# Altium schematic sheet DE0_Nano.SchDoc
size A4; Author: Audran; CompanyName: Goldorak; Address1: Electrolab; Address2: 52 rue Paul Lescop; Address3: 92000 Nanterre; DocumentNumber: 3; SheetNumber: 3; SheetTotal: 8; ProjectName: Cartes_2017
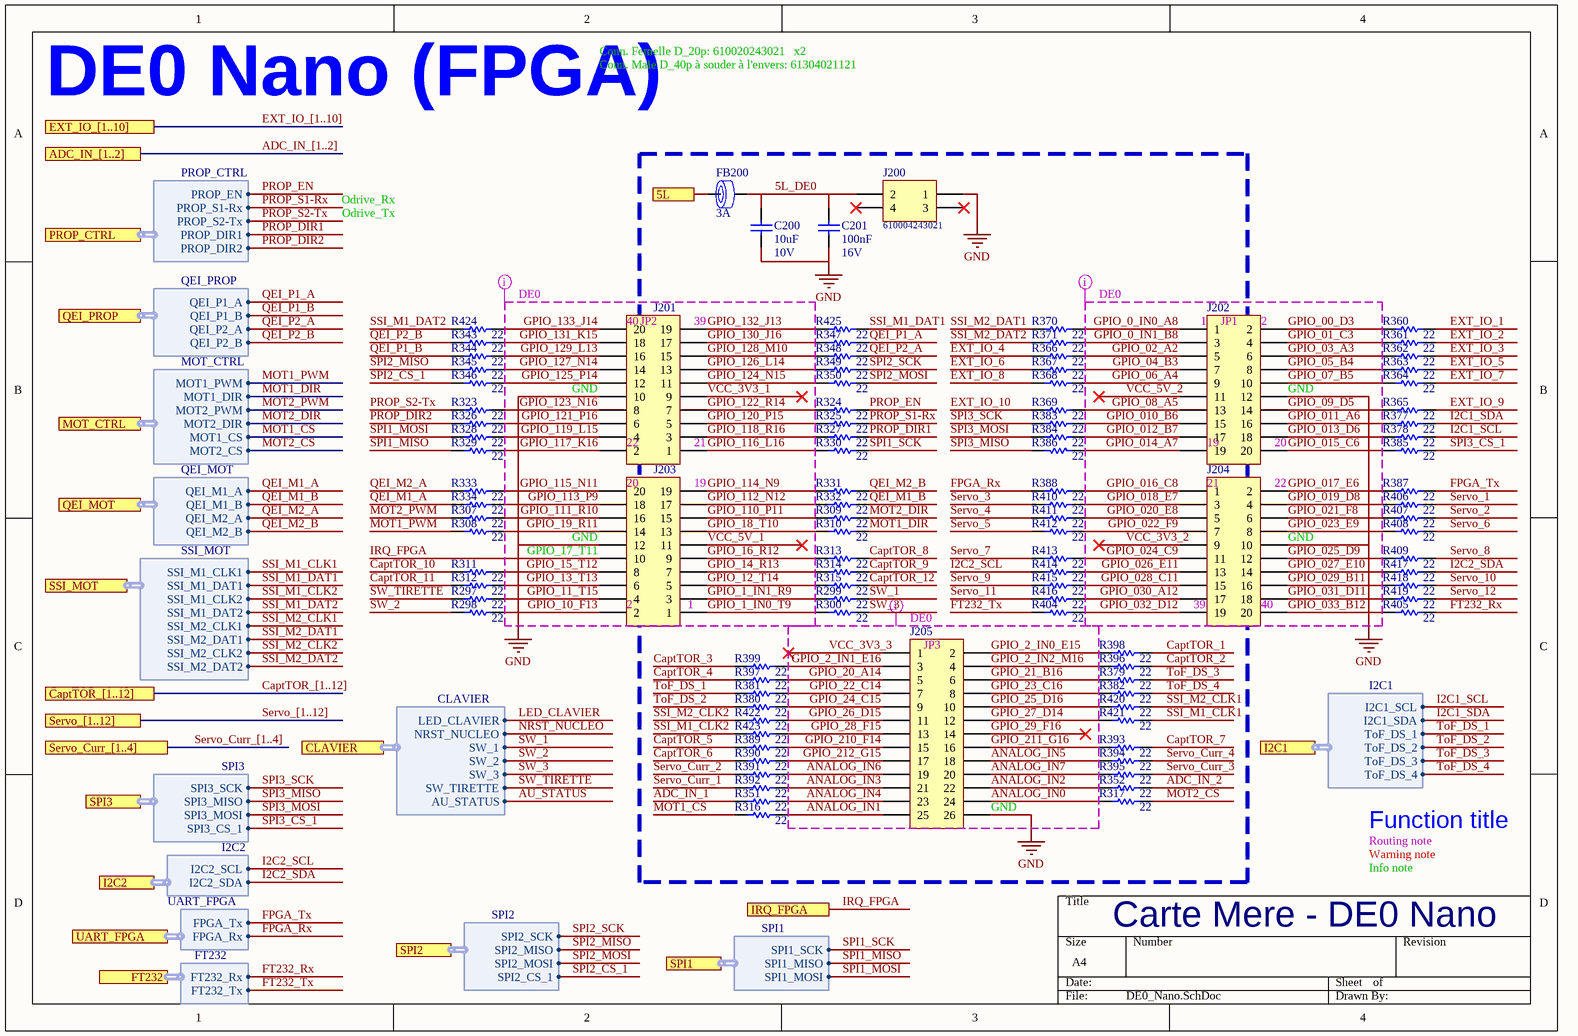
[diagram p0: DE0_Nano.SchDoc]

## Parts
C200  10uF  RatedVoltage: 10V  [WCAP-CSGP_0805, 2x1.25x1.25]
C201  100nF  RatedVoltage: 16V  [WCAP-CSGP_0402, 1x0.5x0.5]
FB200  RatedCurrent: 3A  [WE-CBF_0805_High Current]  (hidden comment: 742792023)
J200  610004243021  [610004243021_NO-HOLE]
J201  610020243021  [610020243021_NO-HOLE]  (value not drawn)
J202  610020243021  [610020243021_NO-HOLE]  (value not drawn)
J203  610020243021  [610020243021_NO-HOLE]  (value not drawn)
J204  610020243021  [610020243021_NO-HOLE]  (value not drawn)
J205  610026243021  [610026243021_NO-HOLE]  (value not drawn)
R297  value 22  [RESC1005X04N]  (hidden comment: RC0402FR-0722RL)
R298  value 22  [RESC1005X04N]  (hidden comment: RC0402FR-0722RL)
R299  value 22  [RESC1005X04N]  (hidden comment: RC0402FR-0722RL)
R300  value 22  [RESC1005X04N]  (hidden comment: RC0402FR-0722RL)
R307  value 22  [RESC1005X04N]  (hidden comment: RC0402FR-0722RL)
R308  value 22  [RESC1005X04N]  (hidden comment: RC0402FR-0722RL)
R309  value 22  [RESC1005X04N]  (hidden comment: RC0402FR-0722RL)
R310  value 22  [RESC1005X04N]  (hidden comment: RC0402FR-0722RL)
R311  value 22  [RESC1005X04N]  (hidden comment: RC0402FR-0722RL)
R312  value 22  [RESC1005X04N]  (hidden comment: RC0402FR-0722RL)
R313  value 22  [RESC1005X04N]  (hidden comment: RC0402FR-0722RL)
R314  value 22  [RESC1005X04N]  (hidden comment: RC0402FR-0722RL)
R315  value 22  [RESC1005X04N]  (hidden comment: RC0402FR-0722RL)
R316  value 22  [RESC1005X04N]  (hidden comment: RC0402FR-0722RL)
R317  value 22  [RESC1005X04N]  (hidden comment: RC0402FR-0722RL)
R323  value 22  [RESC1005X04N]  (hidden comment: RC0402FR-0722RL)
R324  value 22  [RESC1005X04N]  (hidden comment: RC0402FR-0722RL)
R325  value 22  [RESC1005X04N]  (hidden comment: RC0402FR-0722RL)
R326  value 22  [RESC1005X04N]  (hidden comment: RC0402FR-0722RL)
R327  value 22  [RESC1005X04N]  (hidden comment: RC0402FR-0722RL)
R328  value 22  [RESC1005X04N]  (hidden comment: RC0402FR-0722RL)
R329  value 22  [RESC1005X04N]  (hidden comment: RC0402FR-0722RL)
R330  value 22  [RESC1005X04N]  (hidden comment: RC0402FR-0722RL)
R331  value 22  [RESC1005X04N]  (hidden comment: RC0402FR-0722RL)
R332  value 22  [RESC1005X04N]  (hidden comment: RC0402FR-0722RL)
R333  value 22  [RESC1005X04N]  (hidden comment: RC0402FR-0722RL)
R334  value 22  [RESC1005X04N]  (hidden comment: RC0402FR-0722RL)
R343  value 22  [RESC1005X04N]  (hidden comment: RC0402FR-0722RL)
R344  value 22  [RESC1005X04N]  (hidden comment: RC0402FR-0722RL)
R345  value 22  [RESC1005X04N]  (hidden comment: RC0402FR-0722RL)
R346  value 22  [RESC1005X04N]  (hidden comment: RC0402FR-0722RL)
R347  value 22  [RESC1005X04N]  (hidden comment: RC0402FR-0722RL)
R348  value 22  [RESC1005X04N]  (hidden comment: RC0402FR-0722RL)
R349  value 22  [RESC1005X04N]  (hidden comment: RC0402FR-0722RL)
R350  value 22  [RESC1005X04N]  (hidden comment: RC0402FR-0722RL)
R351  value 22  [RESC1005X04N]  (hidden comment: RC0402FR-0722RL)
R352  value 22  [RESC1005X04N]  (hidden comment: RC0402FR-0722RL)
R360  value 22  [RESC1005X04N]  (hidden comment: RC0402FR-0722RL)
R361  value 22  [RESC1005X04N]  (hidden comment: RC0402FR-0722RL)
R362  value 22  [RESC1005X04N]  (hidden comment: RC0402FR-0722RL)
R363  value 22  [RESC1005X04N]  (hidden comment: RC0402FR-0722RL)
R364  value 22  [RESC1005X04N]  (hidden comment: RC0402FR-0722RL)
R365  value 22  [RESC1005X04N]  (hidden comment: RC0402FR-0722RL)
R366  value 22  [RESC1005X04N]  (hidden comment: RC0402FR-0722RL)
R367  value 22  [RESC1005X04N]  (hidden comment: RC0402FR-0722RL)
R368  value 22  [RESC1005X04N]  (hidden comment: RC0402FR-0722RL)
R369  value 22  [RESC1005X04N]  (hidden comment: RC0402FR-0722RL)
R370  value 22  [RESC1005X04N]  (hidden comment: RC0402FR-0722RL)
R371  value 22  [RESC1005X04N]  (hidden comment: RC0402FR-0722RL)
R377  value 22  [RESC1005X04N]  (hidden comment: RC0402FR-0722RL)
R378  value 22  [RESC1005X04N]  (hidden comment: RC0402FR-0722RL)
R379  value 22  [RESC1005X04N]  (hidden comment: RC0402FR-0722RL)
R380  value 22  [RESC1005X04N]  (hidden comment: RC0402FR-0722RL)
R381  value 22  [RESC1005X04N]  (hidden comment: RC0402FR-0722RL)
R382  value 22  [RESC1005X04N]  (hidden comment: RC0402FR-0722RL)
R383  value 22  [RESC1005X04N]  (hidden comment: RC0402FR-0722RL)
R384  value 22  [RESC1005X04N]  (hidden comment: RC0402FR-0722RL)
R385  value 22  [RESC1005X04N]  (hidden comment: RC0402FR-0722RL)
R386  value 22  [RESC1005X04N]  (hidden comment: RC0402FR-0722RL)
R387  value 22  [RESC1005X04N]  (hidden comment: RC0402FR-0722RL)
R388  value 22  [RESC1005X04N]  (hidden comment: RC0402FR-0722RL)
R389  value 22  [RESC1005X04N]  (hidden comment: RC0402FR-0722RL)
R390  value 22  [RESC1005X04N]  (hidden comment: RC0402FR-0722RL)
R391  value 22  [RESC1005X04N]  (hidden comment: RC0402FR-0722RL)
R392  value 22  [RESC1005X04N]  (hidden comment: RC0402FR-0722RL)
R393  value 22  [RESC1005X04N]  (hidden comment: RC0402FR-0722RL)
R394  value 22  [RESC1005X04N]  (hidden comment: RC0402FR-0722RL)
R395  value 22  [RESC1005X04N]  (hidden comment: RC0402FR-0722RL)
R396  value 22  [RESC1005X04N]  (hidden comment: RC0402FR-0722RL)
R397  value 22  [RESC1005X04N]  (hidden comment: RC0402FR-0722RL)
R398  value 22  [RESC1005X04N]  (hidden comment: RC0402FR-0722RL)
R399  value 22  [RESC1005X04N]  (hidden comment: RC0402FR-0722RL)
R404  value 22  [RESC1005X04N]  (hidden comment: RC0402FR-0722RL)
R405  value 22  [RESC1005X04N]  (hidden comment: RC0402FR-0722RL)
R406  value 22  [RESC1005X04N]  (hidden comment: RC0402FR-0722RL)
R407  value 22  [RESC1005X04N]  (hidden comment: RC0402FR-0722RL)
R408  value 22  [RESC1005X04N]  (hidden comment: RC0402FR-0722RL)
R409  value 22  [RESC1005X04N]  (hidden comment: RC0402FR-0722RL)
R410  value 22  [RESC1005X04N]  (hidden comment: RC0402FR-0722RL)
R411  value 22  [RESC1005X04N]  (hidden comment: RC0402FR-0722RL)
R412  value 22  [RESC1005X04N]  (hidden comment: RC0402FR-0722RL)
R413  value 22  [RESC1005X04N]  (hidden comment: RC0402FR-0722RL)
R414  value 22  [RESC1005X04N]  (hidden comment: RC0402FR-0722RL)
R415  value 22  [RESC1005X04N]  (hidden comment: RC0402FR-0722RL)
R416  value 22  [RESC1005X04N]  (hidden comment: RC0402FR-0722RL)
R417  value 22  [RESC1005X04N]  (hidden comment: RC0402FR-0722RL)
R418  value 22  [RESC1005X04N]  (hidden comment: RC0402FR-0722RL)
R419  value 22  [RESC1005X04N]  (hidden comment: RC0402FR-0722RL)
R420  value 22  [RESC1005X04N]  (hidden comment: RC0402FR-0722RL)
R421  value 22  [RESC1005X04N]  (hidden comment: RC0402FR-0722RL)
R422  value 22  [RESC1005X04N]  (hidden comment: RC0402FR-0722RL)
R423  value 22  [RESC1005X04N]  (hidden comment: RC0402FR-0722RL)
R424  value 22  [RESC1005X04N]  (hidden comment: RC0402FR-0722RL)
R425  value 22  [RESC1005X04N]  (hidden comment: RC0402FR-0722RL)

## Ports
5L, ADC_IN_[1..2], CaptTOR_[1..12], CLAVIER (harness CLAVIER), EXT_IO_[1..10], FT232 (harness FT232), I2C1 (harness I2C1), I2C2 (harness I2C2), IRQ_FPGA, MOT_CTRL (harness MOT_CTRL), PROP_CTRL (harness PROP_CTRL), QEI_MOT (harness QEI_MOT), QEI_PROP (harness QEI_PROP), Servo_[1..12], Servo_Curr_[1..4] (harness CLAVIER), SPI1 (harness SPI1), SPI2 (harness SPI2), SPI3 (harness SPI3), SSI_MOT (harness SSI_MOT), UART_FPGA (harness UART_FPGA)

## Harnesses
PROP_CTRL: PROP_EN, PROP_S1-Rx, PROP_S2-Tx, PROP_DIR1, PROP_DIR2
QEI_PROP: QEI_P1_A, QEI_P1_B, QEI_P2_A, QEI_P2_B
MOT_CTRL: MOT1_PWM, MOT1_DIR, MOT2_PWM, MOT2_DIR, MOT1_CS, MOT2_CS
QEI_MOT: QEI_M1_A, QEI_M1_B, QEI_M2_A, QEI_M2_B
SSI_MOT: SSI_M1_CLK1, SSI_M1_DAT1, SSI_M1_CLK2, SSI_M1_DAT2, SSI_M2_CLK1, SSI_M2_DAT1, SSI_M2_CLK2, SSI_M2_DAT2
SPI3: SPI3_SCK, SPI3_MISO, SPI3_MOSI, SPI3_CS_1
I2C2: I2C2_SCL, I2C2_SDA
UART_FPGA: FPGA_Tx, FPGA_Rx
FT232: FT232_Tx, FT232_Rx
SPI2: SPI2_SCK, SPI2_MISO, SPI2_MOSI, SPI2_CS_1
SPI1: SPI1_SCK, SPI1_MISO, SPI1_MOSI
I2C1: I2C1_SCL, I2C1_SDA, ToF_DS_1, ToF_DS_2, ToF_DS_3, ToF_DS_4
CLAVIER: LED_CLAVIER, NRST_NUCLEO, SW_1, SW_2, SW_3, SW_TIRETTE, AU_STATUS

## Nets
GND: C200.2 C201.2 J200.1 J201.10 J202.12 J203.12 J204.10 J205.26
5L: FB200.1 ; port 5L
5L_DE0: C200.1 C201.1 FB200.2 J200.2
ADC_IN_1: R351.1
ADC_IN_2: R352.2
ANALOG_IN0: J205.24 R317.1
ANALOG_IN1: J205.25 R316.2
ANALOG_IN2: J205.22 R352.1
ANALOG_IN3: J205.21 R392.2
ANALOG_IN4: J205.23 R351.2
ANALOG_IN5: J205.18 R394.1
ANALOG_IN6: J205.19 R391.2
ANALOG_IN7: J205.20 R395.1
AU_STATUS: port CLAVIER.AU_STATUS
CaptTOR_1: R398.2
CaptTOR_2: R396.1
CaptTOR_3: R399.2
CaptTOR_4: R397.1
CaptTOR_5: R389.1
CaptTOR_6: R390.1
CaptTOR_7: R393.2
CaptTOR_8: R313.2
CaptTOR_9: R314.2
CaptTOR_10: R311.1
CaptTOR_11: R312.1
CaptTOR_12: R315.2
EXT_IO_1: R360.2
EXT_IO_2: R361.2
EXT_IO_3: R362.2
EXT_IO_4: R366.1
EXT_IO_5: R363.2
EXT_IO_6: R367.1
EXT_IO_7: R364.2
EXT_IO_8: R368.1
EXT_IO_9: R365.2
EXT_IO_10: R369.1
FPGA_Rx: R388.1 ; port UART_FPGA.FPGA_Rx
FPGA_Tx: R387.2 ; port UART_FPGA.FPGA_Tx
FT232_Rx: R405.2 ; port FT232.FT232_Rx
FT232_Tx: R404.1 ; port FT232.FT232_Tx
GPIO_00_D3: J202.2 R360.1
GPIO_0_IN0_A8: J202.1 R370.2
GPIO_0_IN1_B8: J202.3 R371.2
GPIO_01_C3: J202.4 R361.1
GPIO_1_IN0_T9: J203.1 R300.1
GPIO_1_IN1_R9: J203.3 R299.1
GPIO_02_A2: J202.5 R366.2
GPIO_2_IN0_E15: J205.2 R398.1
GPIO_2_IN1_E16: J205.3 R399.1
GPIO_2_IN2_M16: J205.4 R396.2
GPIO_03_A3: J202.6 R362.1
GPIO_04_B3: J202.7 R367.2
GPIO_05_B4: J202.8 R363.1
GPIO_06_A4: J202.9 R368.2
GPIO_07_B5: J202.10 R364.1
GPIO_08_A5: J202.13 R369.2
GPIO_09_D5: J202.14 R365.1
GPIO_010_B6: J202.15 R383.2
GPIO_10_F13: J203.2 R298.2
GPIO_011_A6: J202.16 R377.1
GPIO_11_T15: J203.4 R297.2
GPIO_012_B7: J202.17 R384.2
GPIO_12_T14: J203.5 R315.1
GPIO_013_D6: J202.18 R378.1
GPIO_13_T13: J203.6 R312.2
GPIO_014_A7: J202.19 R386.1
GPIO_14_R13: J203.7 R314.1
GPIO_015_C6: J202.20 R385.1
GPIO_15_T12: J203.8 R311.2
GPIO_016_C8: J204.1 R388.2
GPIO_16_R12: J203.9 R313.1
GPIO_017_E6: J204.2 R387.1
GPIO_018_E7: J204.3 R410.2
GPIO_18_T10: J203.13 R310.1
GPIO_019_D8: J204.4 R406.1
GPIO_19_R11: J203.14 R308.2
GPIO_20_A14: J205.5 R397.2
GPIO_020_E8: J204.5 R411.2
GPIO_21_B16: J205.6 R379.1
GPIO_021_F8: J204.6 R407.1
GPIO_22_C14: J205.7 R381.2
GPIO_022_F9: J204.7 R412.2
GPIO_23_C16: J205.8 R382.2
GPIO_023_E9: J204.8 R408.1
GPIO_024_C9: J204.11 R413.2
GPIO_24_C15: J205.9 R380.2
GPIO_025_D9: J204.12 R409.1
GPIO_25_D16: J205.10 R420.1
GPIO_26_D15: J205.11 R422.2
GPIO_026_E11: J204.13 R414.2
GPIO_27_D14: J205.12 R421.1
GPIO_027_E10: J204.14 R417.1
GPIO_028_C11: J204.15 R415.2
GPIO_28_F15: J205.13 R423.2
GPIO_029_B11: J204.16 R418.1
GPIO_29_F16: J205.14
GPIO_030_A12: J204.17 R416.2
GPIO_031_D11: J204.18 R419.1
GPIO_032_D12: J204.19 R404.2
GPIO_033_B12: J204.20 R405.1
GPIO_110_P11: J203.15 R309.1
GPIO_111_R10: J203.16 R307.2
GPIO_112_N12: J203.17 R332.1
GPIO_113_P9: J203.18 R334.2
GPIO_114_N9: J203.19 R331.1
GPIO_115_N11: J203.20 R333.2
GPIO_116_L16: J201.1 R330.1
GPIO_117_K16: J201.2 R329.2
GPIO_118_R16: J201.3 R327.1
GPIO_119_L15: J201.4 R328.2
GPIO_120_P15: J201.5 R325.1
GPIO_121_P16: J201.6 R326.2
GPIO_122_R14: J201.7 R324.1
GPIO_123_N16: J201.8 R323.2
GPIO_124_N15: J201.11 R350.1
GPIO_125_P14: J201.12 R346.2
GPIO_126_L14: J201.13 R349.1
GPIO_127_N14: J201.14 R345.2
GPIO_128_M10: J201.15 R348.1
GPIO_129_L13: J201.16 R344.2
GPIO_130_J16: J201.17 R347.1
GPIO_131_K15: J201.18 R343.2
GPIO_132_J13: J201.19 R425.1
GPIO_133_J14: J201.20 R424.2
GPIO_210_F14: J205.15 R389.2
GPIO_211_G16: J205.16 R393.1
GPIO_212_G15: J205.17 R390.2
I2C1_SCL: R378.2 ; port I2C1.I2C1_SCL
I2C1_SDA: R377.2 ; port I2C1.I2C1_SDA
I2C2_SCL: R414.1 ; port I2C2.I2C2_SCL
I2C2_SDA: R417.2 ; port I2C2.I2C2_SDA
IRQ_FPGA: J203.10 ; port IRQ_FPGA
LED_CLAVIER: port CLAVIER.LED_CLAVIER
MOT1_CS: R316.1 ; port MOT_CTRL.MOT1_CS
MOT1_DIR: R310.2 ; port MOT_CTRL.MOT1_DIR
MOT1_PWM: R308.1 ; port MOT_CTRL.MOT1_PWM
MOT2_CS: R317.2 ; port MOT_CTRL.MOT2_CS
MOT2_DIR: R309.2 ; port MOT_CTRL.MOT2_DIR
MOT2_PWM: R307.1 ; port MOT_CTRL.MOT2_PWM
NRST_NUCLEO: port CLAVIER.NRST_NUCLEO
PROP_DIR1: R327.2 ; port PROP_CTRL.PROP_DIR1
PROP_DIR2: R326.1 ; port PROP_CTRL.PROP_DIR2
PROP_EN: R324.2 ; port PROP_CTRL.PROP_EN
PROP_S1-Rx: R325.2 ; port PROP_CTRL.PROP_S1-Rx
PROP_S2-Tx: R323.1 ; port PROP_CTRL.PROP_S2-Tx
QEI_M1_A: R334.1 ; port QEI_MOT.QEI_M1_A
QEI_M1_B: R332.2 ; port QEI_MOT.QEI_M1_B
QEI_M2_A: R333.1 ; port QEI_MOT.QEI_M2_A
QEI_M2_B: R331.2 ; port QEI_MOT.QEI_M2_B
QEI_P1_A: R347.2 ; port QEI_PROP.QEI_P1_A
QEI_P1_B: R344.1 ; port QEI_PROP.QEI_P1_B
QEI_P2_A: R348.2 ; port QEI_PROP.QEI_P2_A
QEI_P2_B: R343.1 ; port QEI_PROP.QEI_P2_B
Servo_1: R406.2
Servo_2: R407.2
Servo_3: R410.1
Servo_4: R411.1
Servo_5: R412.1
Servo_6: R408.2
Servo_7: R413.1
Servo_8: R409.2
Servo_9: R415.1
Servo_10: R418.2
Servo_11: R416.1
Servo_12: R419.2
Servo_Curr_1: R392.1
Servo_Curr_2: R391.1
Servo_Curr_3: R395.2
Servo_Curr_4: R394.2
SPI1_MISO: R329.1 ; port SPI1.SPI1_MISO
SPI1_MOSI: R328.1 ; port SPI1.SPI1_MOSI
SPI1_SCK: R330.2 ; port SPI1.SPI1_SCK
SPI2_CS_1: R346.1 ; port SPI2.SPI2_CS_1
SPI2_MISO: R345.1 ; port SPI2.SPI2_MISO
SPI2_MOSI: R350.2 ; port SPI2.SPI2_MOSI
SPI2_SCK: R349.2 ; port SPI2.SPI2_SCK
SPI3_CS_1: R385.2 ; port SPI3.SPI3_CS_1
SPI3_MISO: R386.2 ; port SPI3.SPI3_MISO
SPI3_MOSI: R384.1 ; port SPI3.SPI3_MOSI
SPI3_SCK: R383.1 ; port SPI3.SPI3_SCK
SSI_M1_CLK1: R421.2 ; port SSI_MOT.SSI_M1_CLK1
SSI_M1_CLK2: R423.1 ; port SSI_MOT.SSI_M1_CLK2
SSI_M1_DAT1: R425.2 ; port SSI_MOT.SSI_M1_DAT1
SSI_M1_DAT2: R424.1 ; port SSI_MOT.SSI_M1_DAT2
SSI_M2_CLK1: R420.2 ; port SSI_MOT.SSI_M2_CLK1
SSI_M2_CLK2: R422.1 ; port SSI_MOT.SSI_M2_CLK2
SSI_M2_DAT1: R370.1 ; port SSI_MOT.SSI_M2_DAT1
SSI_M2_DAT2: R371.1 ; port SSI_MOT.SSI_M2_DAT2
SW_1: R299.2 ; port CLAVIER.SW_1
SW_2: R298.1 ; port CLAVIER.SW_2
SW_3: R300.2 ; port CLAVIER.SW_3
SW_TIRETTE: R297.1 ; port CLAVIER.SW_TIRETTE
ToF_DS_1: R381.1 ; port I2C1.ToF_DS_1
ToF_DS_2: R380.1 ; port I2C1.ToF_DS_2
ToF_DS_3: R379.2 ; port I2C1.ToF_DS_3
ToF_DS_4: R382.1 ; port I2C1.ToF_DS_4
VCC_3V3_1: J201.9
VCC_3V3_2: J204.9
VCC_3V3_3: J205.1
VCC_5V_1: J203.11
VCC_5V_2: J202.11

Not connected (* = marked no-connect by the designer): J200 3* 4*

## Buses and harness runs
bus ADC_IN_[1..2] = port ADC_IN_[1..2]
bus CaptTOR_[1..12] = port CaptTOR_[1..12]
bus EXT_IO_[1..10] = port EXT_IO_[1..10]
bus Servo_[1..12] = port Servo_[1..12]
bus Servo_Curr_[1..4]

## Layout directives
net class DE0: ANALOG_IN0, ANALOG_IN1, ANALOG_IN2, ANALOG_IN3, ANALOG_IN4, ANALOG_IN5, ANALOG_IN6, ANALOG_IN7, GND, GPIO_00_D3, GPIO_0_IN0_A8, GPIO_0_IN1_B8, GPIO_01_C3, GPIO_1_IN0_T9, GPIO_1_IN1_R9, GPIO_02_A2, GPIO_2_IN0_E15, GPIO_2_IN1_E16, GPIO_2_IN2_M16, GPIO_03_A3, GPIO_04_B3, GPIO_05_B4, GPIO_06_A4, GPIO_07_B5, GPIO_08_A5, GPIO_09_D5, GPIO_010_B6, GPIO_10_F13, GPIO_011_A6, GPIO_11_T15, GPIO_012_B7, GPIO_12_T14, GPIO_013_D6, GPIO_13_T13, GPIO_014_A7, GPIO_14_R13, GPIO_015_C6, GPIO_15_T12, GPIO_016_C8, GPIO_16_R12, GPIO_017_E6, GPIO_018_E7, GPIO_18_T10, GPIO_019_D8, GPIO_19_R11, GPIO_20_A14, GPIO_020_E8, GPIO_21_B16, GPIO_021_F8, GPIO_22_C14, GPIO_022_F9, GPIO_23_C16, GPIO_023_E9, GPIO_024_C9, GPIO_24_C15, GPIO_025_D9, GPIO_25_D16, GPIO_26_D15, GPIO_026_E11, GPIO_27_D14, GPIO_027_E10, GPIO_028_C11, GPIO_28_F15, GPIO_029_B11, GPIO_29_F16, GPIO_030_A12, GPIO_031_D11, GPIO_032_D12, GPIO_033_B12, GPIO_110_P11, GPIO_111_R10, GPIO_112_N12, GPIO_113_P9, GPIO_114_N9, GPIO_115_N11, GPIO_116_L16, GPIO_117_K16, GPIO_118_R16, GPIO_119_L15, GPIO_120_P15, GPIO_121_P16, GPIO_122_R14, GPIO_123_N16, GPIO_124_N15, GPIO_125_P14, GPIO_126_L14, GPIO_127_N14, GPIO_128_M10, GPIO_129_L13, GPIO_130_J16, GPIO_131_K15, GPIO_132_J13, GPIO_133_J14, GPIO_210_F14, GPIO_211_G16, GPIO_212_G15, VCC_3V3_1, VCC_3V3_2, VCC_3V3_3, VCC_5V_1, VCC_5V_2

## Notes on the sheet
- DE0 Nano (FPGA)
- Conn. Male D_40p à souder à l'envers: 61304021121
- Conn. Femelle D_20p: 610020243021   x2
- Odrive_Tx
- Odrive_Rx
- (near J201) 40
- (near J201) JP2
- (near J201) 39
- (near J202) 1
- (near J202) JP1
- (near J202) 2
- (near J201) GND
- (near J201) 22
- (near J201) 21
- (near J202) 19
- (near J202) 20
- (near J202) GND
- (near J203) 20
- (near J203) 19
- (near J204) 21
- (near J204) 22
- (near J203) GND
- GPIO_17_T11
- (near J204) GND
- (near J203) 2
- (near J203) 1
- (near J205) JP3
- (near J204) 39
- (near J204) 40
- (near J205) GND
- Routing note
- Function title
- Warning note
- Info note
- Carte Mere - DE0 Nano

## Library data of the parts
C200 = WCAP-CSGP, 885012207026: CAP CER 10uF 10V X7R 0805; Manufacturer: Wurth Elektronik; ComponentLink1Description: Datasheet; ComponentLink1URL: http://katalog.we-online.com/pbs/datasheet/885012207026.pdf; Manufacturer Part Number: 885012207026; Value: 10uF; Size: 0805; CeramicType: X7R; Supplier 1: Farnell; Supplier Part Number 1: 2495189; Supplier Part Number 2: C15850; Supplier 2: JLCPCB; Supplier Footprint 2: 0805
C201 = WCAP-CSGP, 885012205037: CAP CER 100nF 16V X7R 0402; Manufacturer: Wurth Elektronik; ComponentLink1Description: Datasheet; ComponentLink1URL: http://katalog.we-online.com/pbs/datasheet/885012205037.pdf; Manufacturer Part Number: 885012205037; Value: 100nF; Size: 0402; CeramicType: X7R; Supplier 2: JLCPCB; Supplier Part Number 2: C1525; Supplier Footprint 2: 0402
FB200 = WE-CBF, 742792023: Ferrite Bead 120ohm 0805 3A; Manufacturer: Wurth Elektronik; Value: 120; ComponentLink1Description: Manufacturer; ComponentLink1URL: https://www.we-online.com/catalog/en/WE-CBF/?sq=742792023#742792023; ComponentLink2Description: Datasheet; ComponentLink2URL: https://www.we-online.com/catalog/datasheet/742792023.pdf; Manufacturer Part Number: 742792023; Supplier 2: JLCPCB; Supplier Part Number 2: C1015; Supplier 1: Farnell; Supplier Part Number 1: 1635732; Supplier Footprint 2: 0805
J200 = 610004243021: WR-PHD Socket Header, SMT, pitch 2.54mm, Dual Row, Vertical, 4p; Manufacturer: Wurth Elektronik; Value: 4; ComponentLink1Description: Datasheet; ComponentLink1URL: https://www.we-online.com/catalog/datasheet/610004243021.pdf; Manufacturer Part Number: 610004243021; Supplier 1: Farnell; Supplier Part Number 1: 2827931
J201-J204 = 610020243021: WR-PHD Socket Header, SMT, pitch 2.54mm, Dual Row, Vertical, 20p; Manufacturer: Wurth Elektronik; Value: 20; ComponentLink1Description: Datasheet; ComponentLink1URL: https://www.we-online.com/catalog/datasheet/610020243021.pdf; Manufacturer Part Number: 610020243021; Supplier 1: Farnell; Supplier Part Number 1: 2827937
J205 = 610026243021: WR-PHD Socket Header, SMT, pitch 2.54mm, Dual Row, Vertical, 26p; Manufacturer: Wurth Elektronik; Value: 26; ComponentLink1Description: Datasheet; ComponentLink1URL: https://www.we-online.com/catalog/datasheet/610026243021.pdf; Manufacturer Part Number: 610026243021; Supplier 1: Farnell; Supplier Part Number 1: 2827940
R297-R300 R307-R317 R323-R334 R343-R352 R360-R371 R377-R399 R404-R425 = RC0402FR-0722RL: RES SMD 22 OHM 1% 1/16W 0402; Manufacturer: Yageo; Power: 63mW; Vmax: 50V; Type: Thick Film; ComponentLink1Description: Manufacturer; ComponentLink1URL: http://www.yageo.com/NewPortal/_en/index.jsp; ComponentLink2Description: Datasheet; ComponentLink2URL: http://www.farnell.com/datasheets/2167052.pdf; Manufacturer Part Number: RC0402FR-0722RL; Supplier 1: Farnell; Supplier Part Number 1: 9239030; Precision: ±1%; Supplier 2: JLCPCB; Supplier Part Number 2: C25092; Supplier Footprint 2: 0402